# Altium schematic sheet EntradasAnalogicas.SchDoc
size A4; SheetNumber: 6; SheetTotal: 10
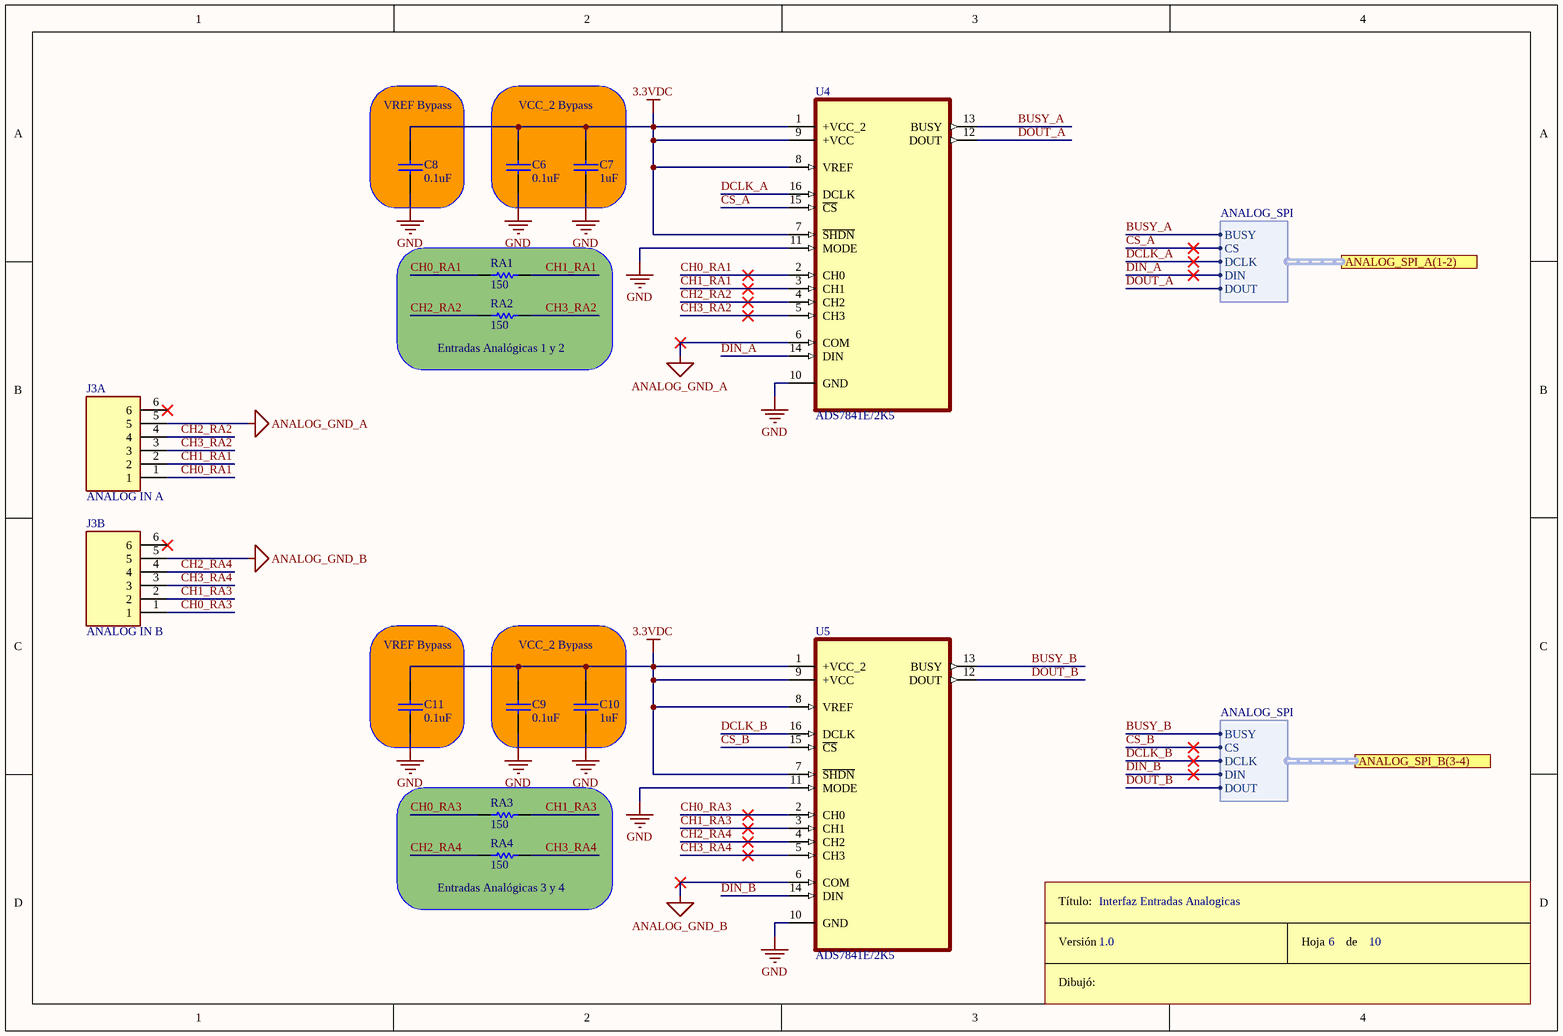
[diagram p0: EntradasAnalogicas.SchDoc]

## Parts
C6  0.1uF  [CAP100]
C7  1uF  [CAP200]
C8  0.1uF  [CAP100]
C9  0.1uF  [CAP100]
C10  1uF  [CAP200]
C11  0.1uF  [CAP100]
J3A  ANALOG IN A  [TE_1586863-6]
J3B  ANALOG IN B  [TE_1586863-6]
RA1  150  [RES400]
RA2  150  [RES400]
RA3  150  [RES400]
RA4  150  [RES400]
ROT4  Rótulo  (value not drawn)  (graphical)
U4  ADS7841E/2K5  [SOP63P600X175-16N]
U5  ADS7841E/2K5  [SOP63P600X175-16N]

## Blocks framed on the sheet
VREF Bypass: C8
VCC_2 Bypass: C6 C7
Entradas Analógicas 1 y 2: RA1 RA2
VREF Bypass: C11
VCC_2 Bypass: C9 C10
Entradas Analógicas 3 y 4: RA3 RA4

## Ports
ANALOG_SPI_A(1-2) (harness ANALOG_SPI), ANALOG_SPI_B(3-4) (harness ANALOG_SPI)

## Harnesses
ANALOG_SPI: BUSY, CS, DCLK, DIN, DOUT

## Nets
3.3VDC: C6.1 C7.1 C8.1 C9.1 C10.1 C11.1 U4.1(+VCC_2) U4.7(~{SHDN}) U4.8(VREF) U4.9(+VCC) U5.1(+VCC_2) U5.7(~{SHDN}) U5.8(VREF) U5.9(+VCC)
ANALOG_GND_A: J3A.5 U4.6(COM)
ANALOG_GND_B: J3B.5 U5.6(COM)
GND: C6.2 C7.2 C8.2 C9.2 C10.2 C11.2 U4.10(GND) U4.11(MODE) U5.10(GND) U5.11(MODE)
BUSY_A: U4.13(BUSY) ; port ANALOG_SPI_A(1-2).BUSY
BUSY_B: U5.13(BUSY) ; port ANALOG_SPI_B(3-4).BUSY
CH0_RA1: J3A.1 RA1.1 U4.2(CH0)
CH0_RA3: J3B.1 RA3.1 U5.2(CH0)
CH1_RA1: J3A.2 RA1.2 U4.3(CH1)
CH1_RA3: J3B.2 RA3.2 U5.3(CH1)
CH2_RA2: J3A.4 RA2.1 U4.4(CH2)
CH2_RA4: J3B.4 RA4.1 U5.4(CH2)
CH3_RA2: J3A.3 RA2.2 U4.5(CH3)
CH3_RA4: J3B.3 RA4.2 U5.5(CH3)
CS_A: U4.15(~{CS}) ; port ANALOG_SPI_A(1-2).CS
CS_B: U5.15(~{CS}) ; port ANALOG_SPI_B(3-4).CS
DCLK_A: U4.16(DCLK) ; port ANALOG_SPI_A(1-2).DCLK
DCLK_B: U5.16(DCLK) ; port ANALOG_SPI_B(3-4).DCLK
DIN_A: U4.14(DIN) ; port ANALOG_SPI_A(1-2).DIN
DIN_B: U5.14(DIN) ; port ANALOG_SPI_B(3-4).DIN
DOUT_A: U4.12(DOUT) ; port ANALOG_SPI_A(1-2).DOUT
DOUT_B: U5.12(DOUT) ; port ANALOG_SPI_B(3-4).DOUT

Not connected (* = marked no-connect by the designer): J3A 6*; J3B 6*

## Notes on the sheet
- Interfaz Entradas Analogicas
- 1.0
- 6
- 10
- (in symbol Rótulo) Título:; Versión; Hoja       de; Dibujó:

## Library data of the parts
C6-C11 = CAP
J3A J3B = 1586863-6: Conn Power HDR 6 POS 4.2mm Solder RA Thru-Hole 6 Terminal 1 Port Tray; MF: TE Connectivity; EU_RoHS_Compliance: Compliant; SnapEDA_Link: https://www.snapeda.com/parts/1586863-6/TE%20Connectivity%20AMP%20Connectors/view-part/1436757/?ref=snap; Price: None; Package: None; TE_purchase_URL: https://www.te.com/usa-en/product-1586863-6.html?te_bu=Cor&te_type=disp&te_campaign=seda_glo_cor-seda-global-disp-prtnr-fy19-seda-model-bom-cta_sma-317_1&elqCampaignId=32493; MP: 1586863-6; Value: *; Availability: Unavailable
RA1-RA4 = RES
U4 U5 = ADS7841E/2K5: ANALOG-TO-DIGITAL CONVERTER; Package: None; Price: None; Value: *; MP: ADS7841E/2K5; Availability: Unavailable